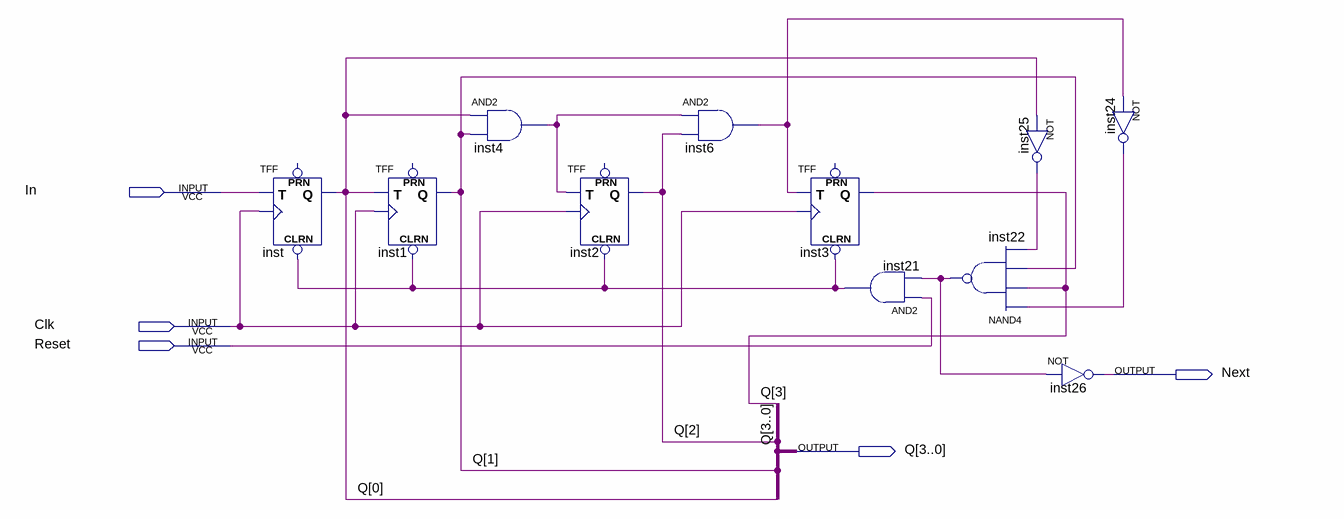
[diagram p0: schematic sheet]
// Quartus schematic Numarator.bdf as structural Verilog: 11 symbols, 5 pins
module Numarator (
  input  In,
  input  Clk,
  input  Reset,
  output Next,
  output [3:0] Q
);

  wire inst4_out, inst6_out, inst21_out, inst22_out, inst24_out, inst25_out;

  TFF inst (.CLRN(inst21_out), .T(In), .CLK(Clk), .Q(Q[0]));  // open: PRN
  TFF inst1 (.CLRN(inst21_out), .T(Q[0]), .CLK(Clk), .Q(Q[1]));  // open: PRN
  and inst4 (inst4_out, Q[0], Q[1]);
  TFF inst2 (.CLRN(inst21_out), .T(inst4_out), .CLK(Clk), .Q(Q[2]));  // open: PRN
  and inst6 (inst6_out, inst4_out, Q[2]);
  TFF inst3 (.CLRN(inst21_out), .T(inst6_out), .CLK(Clk), .Q(Q[3]));  // open: PRN
  and inst21 (inst21_out, Reset, inst22_out);
  nand inst22 (inst22_out, inst24_out, Q[3], Q[1], inst25_out);
  not inst25 (inst25_out, Q[0]);
  not inst26 (Next, inst22_out);
  not inst24 (inst24_out, inst6_out);
endmodule
